# Altium schematic sheet SHDN-S05-V00-Connector.SchDoc: Shutdown Board Connector
size A3; DrawnBy: Jonn Dillon; DocumentNumber: 4; SheetNumber: 4; SheetTotal: 11; Project: Shutdown Board 2020
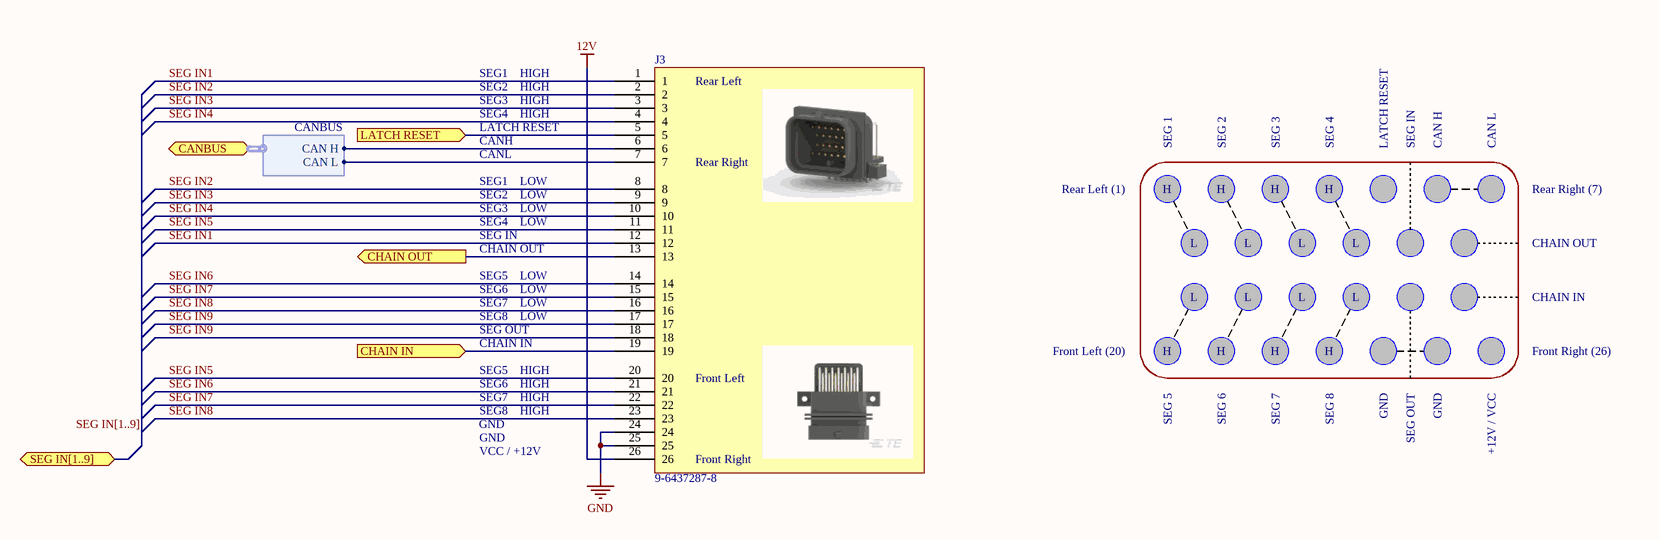
[diagram p0: SHDN-S05-V00-Connector.SchDoc]

## Parts
J3  9-6437287-8  [SUPERSEAL RIGHT 26WAY]

## Ports
CANBUS (bidir, harness CANBUS), CHAIN IN (in), CHAIN OUT (out), LATCH RESET (in), SEG IN[1..9] (bidir)

## Harnesses
CANBUS: CAN H, CAN L

## Nets
12V: J3.26
GND: J3.24 J3.25
CHAIN IN: J3.19 ; port CHAIN IN
CHAIN OUT: J3.13 ; port CHAIN OUT
LATCH RESET: J3.5 ; port LATCH RESET
SEG IN1: J3.1 J3.12
SEG IN2: J3.2 J3.8
SEG IN3: J3.3 J3.9
SEG IN4: J3.4 J3.10
SEG IN5: J3.11 J3.20
SEG IN6: J3.14 J3.21
SEG IN7: J3.15 J3.22
SEG IN8: J3.16 J3.23
SEG IN9: J3.17 J3.18
NetJ3_6: J3.6 ; port CANBUS.CAN H
NetJ3_7: J3.7 ; port CANBUS.CAN L

## Buses and harness runs
bus SEG IN[1..9] = port SEG IN[1..9]

## Notes on the sheet
- SEG1
- SEG2
- HIGH
- LATCH RESET
- SEG3
- CANH
- CANL
- SEG4
- SEG 1
- SEG 2
- SEG 3
- SEG 4
- SEG IN
- CAN H
- CAN L
- LOW
- Rear Left (1)
- H
- Rear Right (7)
- SEG6
- SEG5
- CHAIN OUT
- L
- CHAIN IN
- SEG7
- SEG8
- SEG OUT
- Front Left (20)
- Front Right (26)
- GND
- SEG 5
- SEG 6
- SEG 7
- SEG 8
- +12V / VCC
- VCC / +12V
- Revision History:
- Sheet Title:
- Rev
- Date
- Description
- Project:
- Size:
- Drawn By:
- A3
- Number:
- Revision:
- Sheet
- Version:
- of
- QUT Motorsport
- O-120, Gardens Point
- 2 George Street
- Brisbane, QLD 4000
- Australia
- Print Date:
- Print Time:
- File Name:
- (in symbol 9-6437287-8) Rear Left; Rear Right; Front Left; Front Right

## Library data of the parts
J3 = 9-6437287-8: Connector Header Through Hole, Right Angle 26 position 0.118" (3.00mm)